# EAGLE design Neve (EAGLE 9.7.0)
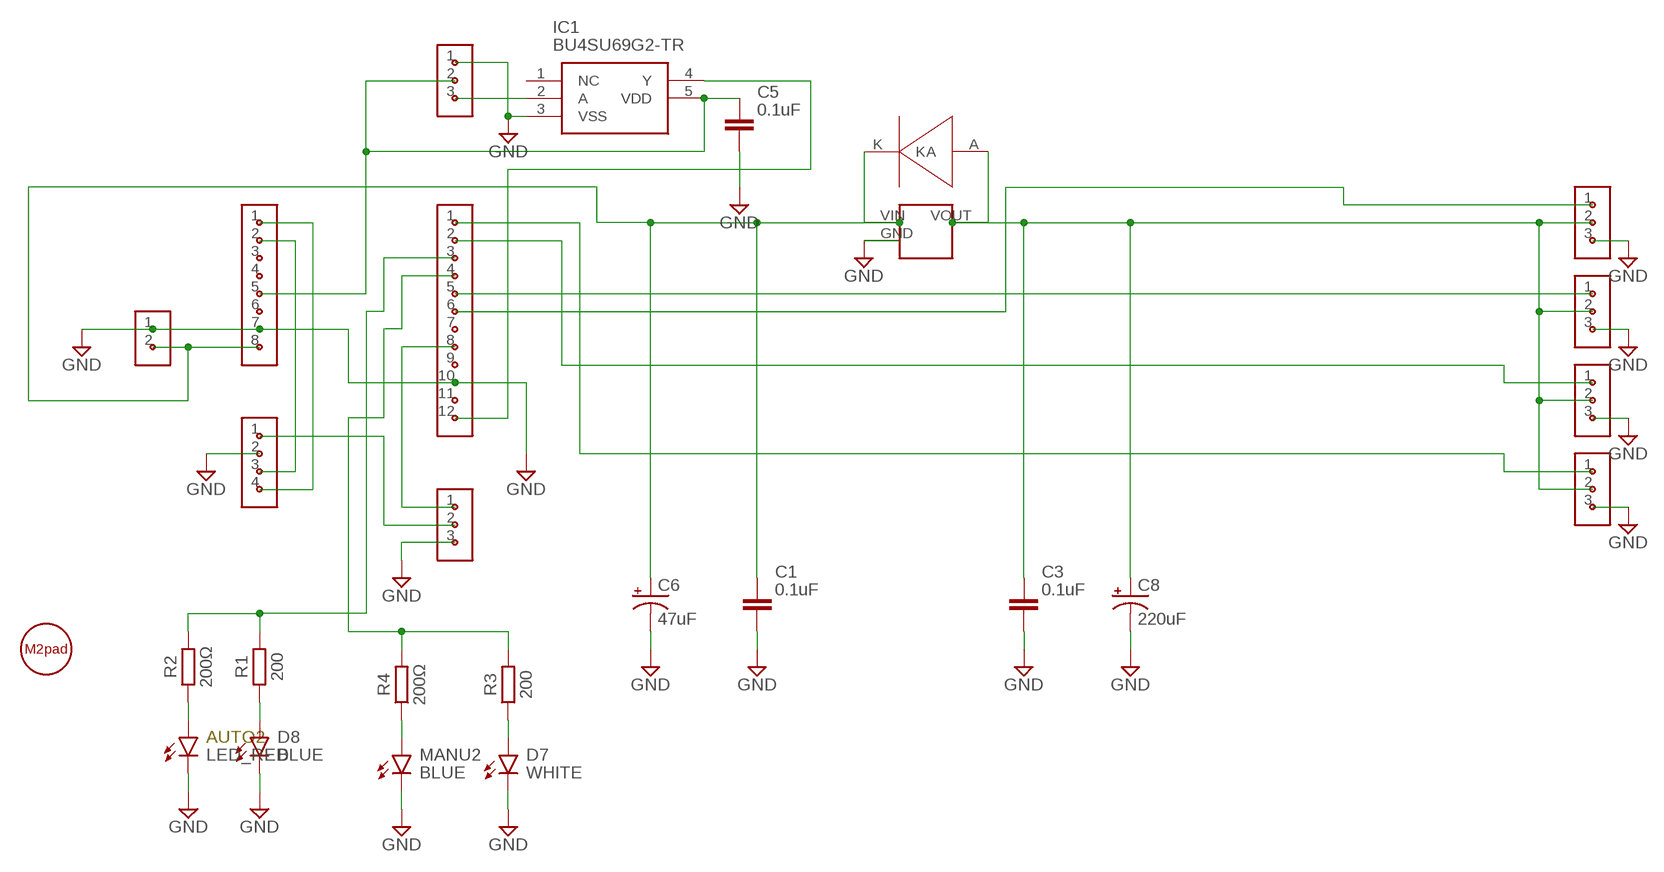
[diagram p0: schematic, sheet 1]

## Parts
AUTO2  LED_RED  CHIP-ROUND-R_0603  [LEDC1608X65N_RND-R]
C1  0.1uF  C_CHIP-0805(2012-METRIC)  [CAPC2012X110]
C3  0.1uF  C_CHIP-0805(2012-METRIC)  [CAPC2012X110]
C5  0.1uF  C_CHIP-0805(2012-METRIC)  [CAPC2012X110]
C6  47uF  CPOL-US153CLV-0605  [153CLV-0605]
C8  220uF  CPOL-US153CLV-0605  [153CLV-0605]
D7  WHITE  CHIP-ROUND-R_0603  [LEDC1608X65N_RND-R]
D8  BLUE  CHIP-ROUND-R_0603  [LEDC1608X65N_RND-R]
DIODE1  CRG01  [CRG01]
IC1  BU4SU69G2-TR  [SOT95P280X125-5N]
JP1  PIN_1X3  [PIN_1X3]
JP2  PIN_1X3  [PIN_1X3]
JP3  PIN_1X3  [PIN_1X3]
JP4  PIN_1X3  [PIN_1X3]
JP5  PIN_1X3  [PIN_1X3]
JP6  PIN_1X4  [PIN_1X4]
JP7  PIN_1X2  [PIN_1X2]
JP8  PIN_1X3  [PIN_1X3]
JP9  PIN_1X12  [PIN_1X12]
JP10  PIN_1X8  [PIN_1X8]
MANU2  BLUE  CHIP-ROUND-R_0603  [LEDC1608X65N_RND-R]
R1  200  R_CHIP-0805(2012-METRIC)  [RESC2012X65]
R2  200Ω  R_CHIP-0805(2012-METRIC)  [RESC2012X65]
R3  200  R_CHIP-0805(2012-METRIC)  [RESC2012X65]
R4  200Ω  R_CHIP-0805(2012-METRIC)  [RESC2012X65]
RG1  NJM7805SDL1  [NJM7805SDL1]
U$1  M2PAD  [M2PAD]

## Nets
ARDUINO_5V: C5.1 IC1.5(VDD) JP8.2 JP10.5
D3_PWM: JP5.1 JP9.8
D5_PWM: JP1.1 JP9.6
D6_PWM: JP2.1 JP9.5
D7_LED_MA: JP9.4 R3.2 R4.2
D8_LED_AU: JP9.3 R1.2 R2.2
D9_PWM: JP3.1 JP9.2
D10_PWM: JP4.1 JP9.1
ESC_5V: JP5.2 JP6.1
GND: AUTO2.C C1.2 C3.2 C5.2 C6.- C8.- D7.C D8.C IC1.3(VSS) JP1.3 JP2.3 JP3.3 JP4.3 JP5.3 JP6.2 JP7.1 JP8.1 JP9.10 JP10.7 MANU2.C RG1.GND
LIPO_2S: C1.1 C6.+ DIODE1.K JP7.2 JP10.8 RG1.VIN
N$7: JP6.3 JP10.2
N$8: JP6.4 JP10.1
N$12: MANU2.A R4.1
N$19: D8.A R1.1
N$20: D7.A R3.1
N$22: AUTO2.A R2.1
SBUS: IC1.2(A) JP8.3
SERVO_5V: C3.1 C8.+ DIODE1.A JP1.2 JP2.2 JP3.2 JP4.2 RG1.VOUT
UART: IC1.4(Y) JP9.12
Unconnected: IC1.1(NC) JP9.7 JP9.9 JP9.11 JP10.3 JP10.4 JP10.6

## Library data of the parts
AUTO2 = LED:CHIP-ROUND-R: LED - Generic; CATEGORY: LED; COLOR: RED; DESCRIPTION: CHIP LED ROUND; SUB-CATEGORY: CHIP; TYPE: ROUND_TOP
C1 C3 C5 = Capacitor:C: Capacitor - Generic; CATEGORY: Capacitor
C6 C8 = adafruit:CPOL-US: POLARIZED CAPACITOR, American symbol
D7 D8 MANU2 = LED:CHIP-ROUND-R: LED - Generic; CATEGORY: LED; COLOR: RED; DESCRIPTION: CHIP LED ROUND; SUB-CATEGORY: CHIP; TYPE: ROUND_TOP; VALUE: LED_RED
DIODE1 = HIKOROBO2021:CRG01
IC1 = SamacSys_Parts:BU4SU69G2-TR: CMOS Logic IC,BU4S, BU4000B Series Source: Datasheet <http://uk.rs-online.com/web/p/products/1682415P>; DESCRIPTION: CMOS Logic IC,BU4S, BU4000B Series; HEIGHT: 1.25mm; MANUFACTURER_NAME: ROHM Semiconductor; MANUFACTURER_PART_NUMBER: BU4SU69G2-TR; RS_PART_NUMBER: 1682415P; RS_PRICE-STOCK: http://uk.rs-online.com/web/p/products/1682415P
JP1-JP5 JP8 = PINS:PIN_1X3
JP6 = PINS:PIN_1X4
JP7 = PINS:PIN_1X2
JP9 = PINS:PIN_1X12
JP10 = PINS:PIN_1X8
R1-R4 = Resistor:R: Resistor Fixed - Generic; CATEGORY: Resistor; SUB-CATEGORY: Fixed
RG1 = HIKOROBO2021:NJM7805SDL1
U$1 = guide_pads:M2PAD

## Board
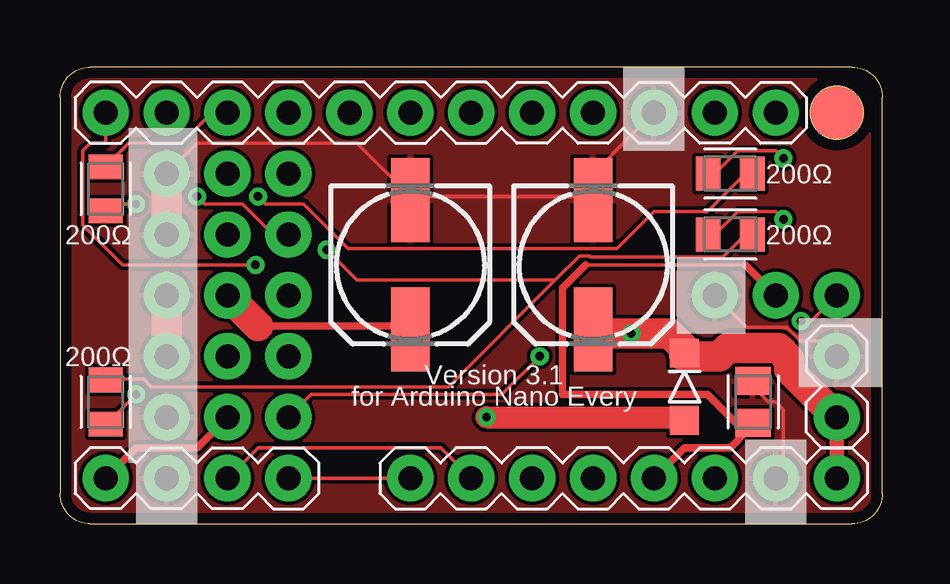
[diagram p1: board, top side]
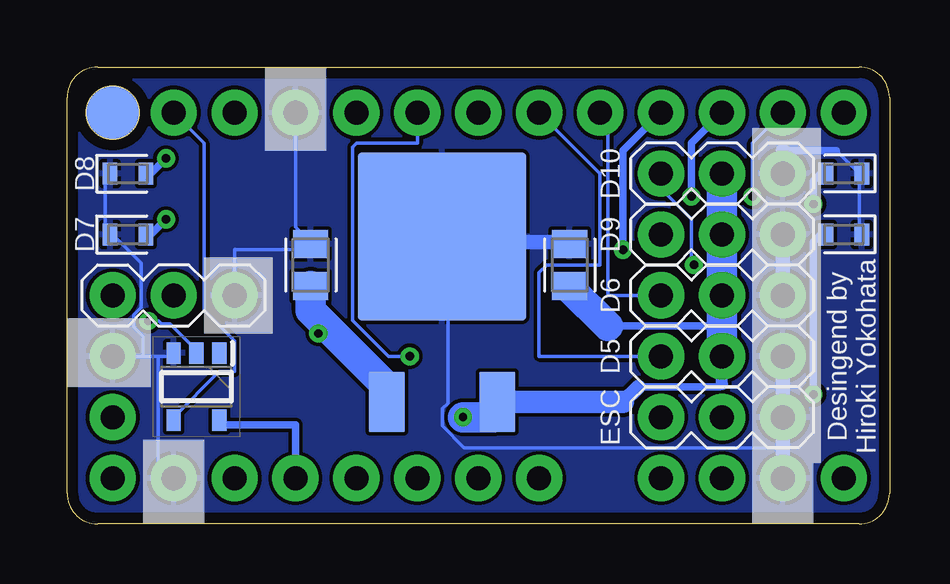
[diagram p2: board, bottom side, seen from below]

Size 34.29 x 19.05 mm. Coordinates in mm from the lower left corner, seen from the top.
Outline: 1.27,0 33.02,0 arc90 34.29,1.27 34.29,17.78 arc90 33.02,19.05 1.27,19.05 arc90 0,17.78 0,1.27 arc90 1.27,0
Outline: circle at 32.38,17.15 radius 1.1
Copper layers (1*16): Top 0.035mm / dielectric 1.5mm / Bottom 0.035mm
Design rules "default *": minimum track width 6mil, minimum drill 0.35mm, track to track 6mil, track to pad 6mil, pad to pad 6mil, via to via 6mil, smd to smd 6mil, copper to edge 18mil, drill to drill 6mil, minimum pad ring 10mil, minimum via ring 8mil, stop-mask expansion 4mil, vias tented up to drill 0mil, thermal gap 6mil

### Footprints (pad centres in the part's own frame; a part is rotated, then mirrored left to right if it is on the bottom)
LEDC1608X65N_RND-R = smd 0.612 x 0.912: A 0.75,0; C -0.75,0
CAPC2012X110 = smd 1.165 x 1.465: 1 -0.875,0; 2 0.875,0
153CLV-0605 = smd 3.5 x 1.6: + 2.7,0; - -2.7,0
CRG01 = smd 1.2 x 1.2: A -1.4,0; K 1.4,0
SOT95P280X125-5N = smd 0.9 x 0.6: 1 -1.4,0.95; 2 -1.4,0; 3 -1.4,-0.95; 4 1.4,-0.95; 5 1.4,0.95
PIN_1X3 = drill 1 pad 1.93: 1 -1.27,-1.27; 2 1.27,-1.27; 3 3.81,-1.27
PIN_1X4 = drill 1 pad 1.93: 1 -3.81,-1.27; 2 -1.27,-1.27; 3 1.27,-1.27; 4 3.81,-1.27
PIN_1X2 = drill 1 pad 1.93: 1 -1.27,-1.27; 2 1.27,-1.27
PIN_1X12 = drill 1 pad 1.93: 1 -13.97,-1.27; 2 -11.43,-1.27; 3 -8.89,-1.27; 4 -6.35,-1.27; 5 -3.81,-1.27; 6 -1.27,-1.27; 7 1.27,-1.27; 8 3.81,-1.27; 9 6.35,-1.27; 10 8.89,-1.27; 11 11.43,-1.27; 12 13.97,-1.27
PIN_1X8 = drill 1 pad 1.93: 1 -8.89,-1.27; 2 -6.35,-1.27; 3 -3.81,-1.27; 4 -1.27,-1.27; 5 1.27,-1.27; 6 3.81,-1.27; 7 6.35,-1.27; 8 8.89,-1.27
RESC2012X65 = smd 1.031 x 1.42: 1 -0.919,0; 2 0.919,0
NJM7805SDL1 = smd 7 x 7: GND 2.3,6.9 | smd 1.5 x 2.5: VIN 0,0; VOUT 4.6,0
M2PAD = smd 2.2 x 2.2: P$1 0,0 | smd 2.2 x 2.2 bottom: P$2 0,0

### Placement (x,y rotation side)
AUTO2  1.91,14.6 180 bottom
C1  24.13,10.8 90 bottom
C3  13.34,10.8 90 bottom
C5  28.89,5.08 90 top
C6  22.23,10.8 270 top
C8  14.6,10.8 270 top
D7  31.75,12.06 0 bottom
D8  31.75,14.6 0 bottom
DIODE1  26.04,5.71 90 top
IC1  28.89,5.71 270 bottom
JP1  8.26,8.26 0 bottom
JP2  8.26,10.8 0 bottom
JP3  8.26,13.34 0 bottom
JP4  8.26,15.88 0 bottom
JP5  8.26,5.71 0 bottom
JP6  5.72,3.17 0 top
JP7  33.65,5.71 270 top
JP8  28.57,8.26 180 bottom
JP9  15.88,18.41 0 top
JP10  23.49,3.17 0 top
MANU2  1.91,12.06 180 bottom
R1  27.94,14.6 0 top
R2  1.91,13.97 90 top
R3  27.94,12.06 0 top
R4  1.91,5.08 90 top
RG1  20.96,5.08 0 bottom
U$1  32.38,17.15 0 top

### Tracks (layer width: path | path; a pad name or v marks a point on that pad's centre or on a via)
ARDUINO_5V
  Top 0.152: 21.91,10.8 28.57,10.8 | 28.57,3.81 28.89,4.13 C5.1 28.57,3.81
  Top 0.305: JP10.5 26.04,3.17 27.94,3.17 28.57,3.81 26.99,5.4 20.96,5.4 20.96,9.84 21.91,10.8 | 28.57,10.8 JP8.2
  Bottom 0.152: 27.94,4.13 IC1.5
  Bottom 0.305: 27.94,4.13 24.77,4.13 JP10.5
D3_PWM  (via drill 0.35)
  Top 0.152: JP5.1 10.48,5.4 18.41,5.4 v20,6.98
  Bottom 0.152: JP9.8 19.68,15.88 22.23,15.88 22.38,15.72 22.38,8.49 20.88,6.98 v20,6.98
D5_PWM
  Bottom 0.152: JP1.1 14.6,6.98 14.6,10.48 14.29,10.8 12.06,10.8 12.06,14.6 JP9.6
D6_PWM
  Bottom 0.152: JP2.1 11.75,9.52 11.75,16.83 JP9.5
D7_LED_MA  (via drill 0.35)
  Top 0.152: 20.64,10.16 16.19,5.71 3.81,5.71 3.49,6.03 1.91,6.03 R4.2 | R3.2 28.57,12.06 27.64,11.13 22.12,11.13 22.07,11.18 21.65,11.18 20.64,10.16 | v11.11,11.43 12.38,10.16 20.64,10.16
  Bottom 0.305: JP9.4 11.11,15.56 v11.11,11.43
D8_LED_AU  (via drill 0.35)
  Top 0.152: JP9.3 6.35,17.15 5.08,15.88 2.86,15.88 1.91,14.92 R2.2 | v8.26,13.65 8.57,13.34 10.16,13.34 12.01,11.48 23.23,11.48 24.77,13.02 26.99,13.02 28.57,14.6 R1.2
  Bottom 0.305: v8.26,13.65 8.26,15.88 JP9.3
D9_PWM  (via drill 0.35)
  Top 0.152: v5.72,13.65 6.03,13.34 7.62,13.34 8.89,12.06 JP3.1
  Bottom 0.152: JP9.2 5.72,15.88 v5.72,13.65
D10_PWM  (via drill 0.35)
  Top 0.152: JP9.1 1.91,15.88 1.27,15.88 0.95,15.56 0.95,12.45 2.61,10.8 v8.15,10.8
  Bottom 0.152: JP4.1 9.52,13.97 8.26,12.7 8.26,11.11 8.15,11.01 v8.15,10.8
ESC_5V
  Top 0.305: JP6.1 3.18,3.17 5.72,3.17 JP5.2
GND
  Top 0.152: JP10.7 30.16,1.91 30.16,4.76 29.85,5.08 29.53,5.08 28.89,5.71 C5.2 | 21.27,13.65 22.23,13.65 C6.- | 21.27,13.65 14.6,13.65 | 21.27,13.65 JP9.10 | JP7.1 31.75,7.62 30.88,7.62 30.31,8.19 28.64,8.19 JP8.1 | JP4.3 5.72,15.88 12.38,15.88 14.6,13.65 | 14.6,13.65 C8.-
  Top 1.27: JP4.3 JP3.3 | JP2.3 JP1.3
  Bottom 0.152: 13.34,11.75 C3.2 | 1.27,14.6 1.27,12.06 MANU2.C | 2.22,15.56 1.27,14.6 | 1.27,14.6 AUTO2.C | RG1.GND 18.41,11.75 18.41,5.03 18.64,4.8 18.64,4.09 17.73,3.17 4.45,3.17 | D8.C 32.7,14.6 32.7,12.06 D7.C 32.38,12.06 31.19,10.87 31.19,9.02 31.5,8.71 31.5,8.21 31.12,7.82 31.12,6.98 | JP7.1 31.12,6.98 | 31.12,6.98 30.48,6.98 | 30.48,6.98 29.85,6.98 IC1.3 | JP10.7 30.48,2.54 30.48,6.98 | JP8.1 27.3,11.43 24.13,11.43 C1.2 24.13,11.75 24.77,12.38 JP9.10
  Bottom 0.305: 4.45,15.56 2.22,15.56
  Bottom 0.61: 18.41,11.75 13.34,11.75 | JP4.3 4.45,15.56 | JP6.2 4.45,3.17 JP5.3 JP1.3 | JP2.3 JP3.3
  pour Top: -0.24,-0.24 34.53,-0.24 34.53,19.29 -0.24,19.29
  pour Bottom: -0.24,-0.24 34.53,-0.24 34.53,19.29 -0.24,19.29
LIPO_2S  (via drill 0.35)
  Top 0.152: 26.04,7.3 DIODE1.K 26.04,6.98 | 22.23,7.94 C6.+
  Top 0.61: JP7.2 JP10.8
  Top 1.27: 26.04,7.3 25.4,7.94 v23.81,7.94 22.23,7.94 | JP7.2 30.41,6.42 30.41,6.86 29.95,7.33 27.83,7.33 27.49,6.98 26.04,6.98
  Bottom 0.152: v23.81,7.94 23.18,7.94
  Bottom 1.27: RG1.VIN 20.96,5.71 23.18,7.94 24.13,8.89 C1.1
N$7
  Top 0.152: JP6.3 8.26,3.17 15.88,3.17 JP10.2
N$8
  Top 0.152: JP10.1 JP6.4
N$12  (via drill 0.35)
  Top 0.152: v3.18,5.4 2.22,4.45 1.91,4.45 R4.1
  Bottom 0.152: 2.86,12.06 MANU2.A
  Bottom 0.305: 2.86,12.06 3.18,11.75 v3.18,5.4
N$19  (via drill 0.35)
  Top 0.152: v30.16,15.24 29.85,15.56 28.26,15.56 27.3,14.6 R1.1
  Bottom 0.152: 30.8,14.6 D8.A
  Bottom 0.305: v30.16,15.24 30.8,14.6
N$20  (via drill 0.35)
  Top 0.152: v30.16,12.7 29.85,13.02 28.26,13.02 27.3,12.06 R3.1
  Bottom 0.152: 30.8,12.06 D7.A
  Bottom 0.305: v30.16,12.7 30.8,12.06
N$22  (via drill 0.35)
  Top 0.152: v3.18,13.34 1.91,13.34 R2.1
  Bottom 0.152: 2.86,14.6 AUTO2.A
  Bottom 0.305: 2.86,14.6 3.18,14.29 v3.18,13.34
SBUS  (via drill 0.35)
  Top 0.152: JP8.3 31.32,8.46 v30.9,8.46
  Bottom 0.152: v30.9,8.46 30.47,8.46 30.34,8.33 29.99,8.33 28.89,7.24 IC1.2
SERVO_5V  (via drill 0.35)
  Top 0.152: 26.04,4.45 DIODE1.A | 14.6,8.26 C8.+
  Top 0.305: 8.26,8.26 14.6,8.26
  Top 0.914: v17.78,4.45 26.04,4.45
  Top 1.27: JP2.2 8.26,8.26
  Bottom 0.152: 16.51,4.45 16.51,5.08 RG1.VOUT | 13.34,9.84 C3.1
  Bottom 0.305: 6.98,8.26 11.75,8.26 | 6.98,5.82 7.09,5.71 10.48,5.71
  Bottom 0.508: 6.98,5.82 JP1.2
  Bottom 0.61: 10.48,5.71 11.11,5.08
  Bottom 0.94: 11.11,5.08 RG1.VOUT
  Bottom 1.27: 16.51,4.45 v17.78,4.45 | JP4.2 JP3.2 JP2.2 6.98,8.26 JP1.2 | 11.75,8.26 13.34,9.84
UART
  Bottom 0.152: JP9.12 28.57,15.88 28.57,8.89 27.3,7.62 27.3,6.35 27.94,6.35 29.85,4.45 IC1.4

### Text on the board
tPlace: 200Ω | 200Ω | 200Ω | 200Ω | Version 3.1 | for Arduino Nano Every
bPlace: D10 | D9 | D6 | Desingend by / Hiroki Yokohata | D5 | ESC